# EAGLE design ui_connector (EAGLE 7.4.0)
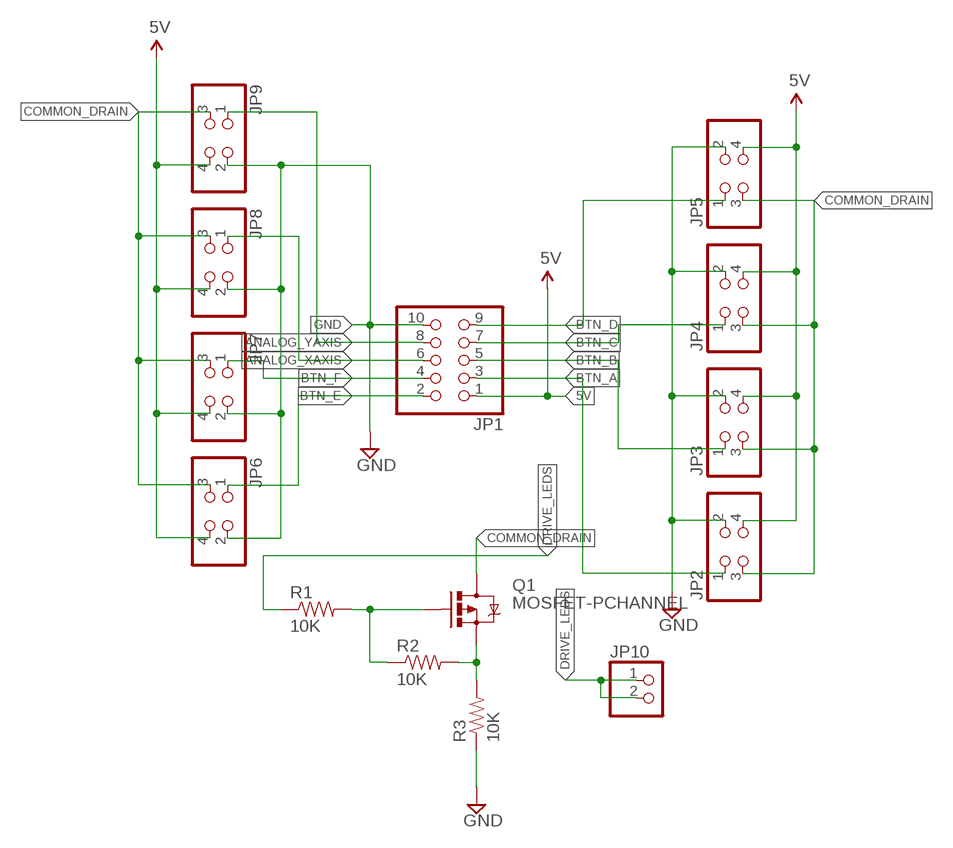
[diagram p0: schematic, sheet 1]

## Parts
JP1  PINHD-2X5  [2X05]
JP2  PINHD-2X2  [2X02]
JP3  PINHD-2X2  [2X02]
JP4  PINHD-2X2  [2X02]
JP5  PINHD-2X2  [2X02]
JP6  PINHD-2X2  [2X02]
JP7  PINHD-2X2  [2X02]
JP8  PINHD-2X2  [2X02]
JP9  PINHD-2X2  [2X02]
JP10  PINHD-1X2  [1X02]
Q1  MOSFET-PCHANNEL  [SOT23-3]
R1  10K  RESISTOR0805-RES  [0805]
R2  10K  RESISTOR0805-RES  [0805]
R3  10K  RESISTOR0805-RES  [0805]

## Nets
5V: JP1.1 JP2.4 JP3.4 JP4.4 JP5.4 JP6.4 JP7.4 JP8.4 JP9.4
ANALOG_XAXIS: JP1.6 JP8.1
ANALOG_YAXIS: JP1.8 JP9.1
BTN_A: JP1.3 JP2.1
BTN_B: JP1.5 JP3.1
BTN_C: JP1.7 JP4.1
BTN_D: JP1.9 JP5.1
BTN_E: JP1.2 JP6.1
BTN_F: JP1.4 JP7.1
COMMON_DRAIN: JP2.3 JP3.3 JP4.3 JP5.3 JP6.3 JP7.3 JP8.3 JP9.3 Q1.3(D)
DRIVE_LEDS: JP10.1 JP10.2 R1.1
GND: JP1.10 JP2.2 JP3.2 JP4.2 JP5.2 JP6.2 JP7.2 JP8.2 JP9.2 R3.1
N$1: Q1.2(S) R2.2 R3.2
N$2: Q1.1(G) R1.2 R2.1

## Library data of the parts
JP1 = pinhead:PINHD-2X5: PIN HEADER
JP2-JP9 = pinhead:PINHD-2X2: PIN HEADER
JP10 = pinhead:PINHD-1X2: PIN HEADER
Q1 = SparkFun-DiscreteSemi:MOSFET-PCHANNEL: Generic PMOSFET IRLML2244 - TRANS-11153 (SOT-23 -20V -4.3A) (1.Gate 2.Source 3.Drain) FQP27P06 - COM-10349 <http://www.sparkfun.com/products/10349> (TO-220 -60V -27A) (1.Gate 2.Source 3.Drain); PROD_ID: TRANS-08285
R1-R3 = SparkFun-Passives:RESISTOR: Resistor Basic schematic elements and footprints for 0603, 1206, and PTH resistors.

## Board
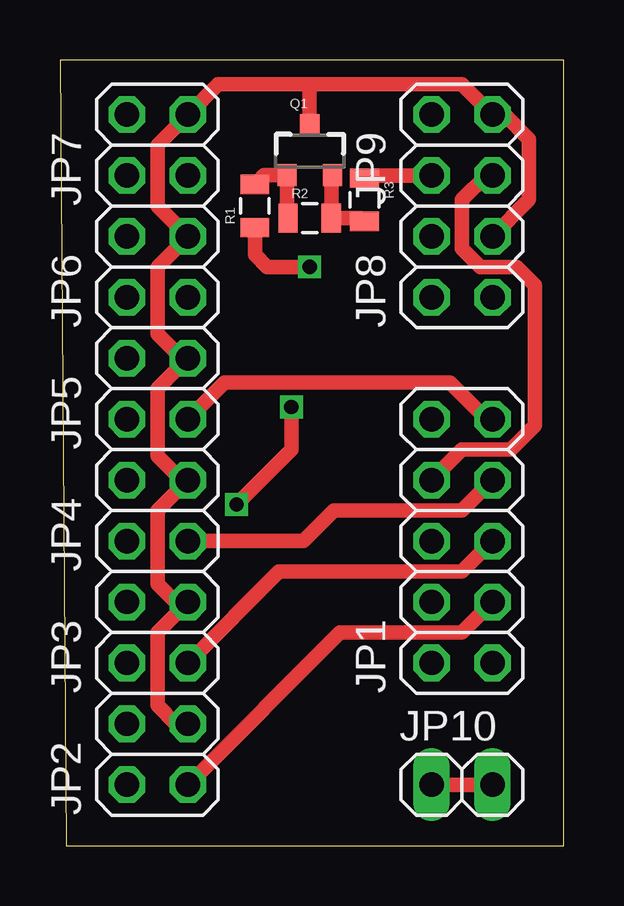
[diagram p1: board, top side]
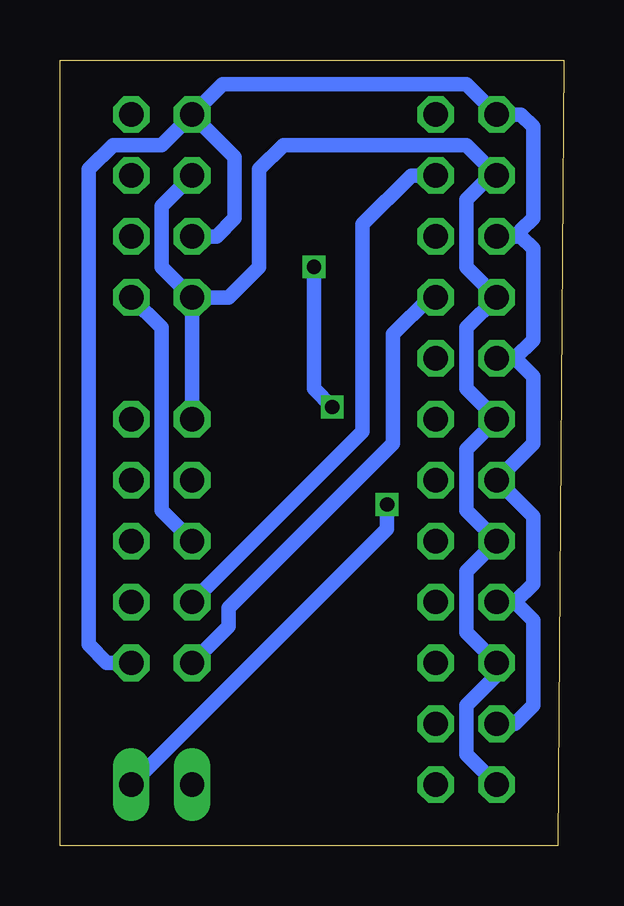
[diagram p2: board, bottom side, seen from below]

Size 21.01 x 32.76 mm. Coordinates in mm from the lower left corner, seen from the top.
Outline: 0.25,0 21.01,0 21.01,32.76 0,32.76 0.25,0
Copper layers (1*16): Top 0.0356mm / dielectric 1.5011mm / Bottom 0.0356mm
Design rules "LaenPCBOrder": minimum track width 6mil, minimum drill 13mil, track to track 6mil, track to pad 6mil, pad to pad 6mil, via to via 6mil, smd to smd 6mil, copper to edge 15mil, drill to drill 6mil, minimum pad ring 7mil, minimum via ring 7mil, stop-mask expansion 3mil, vias tented up to drill 0mil, thermal gap 10mil

### Footprints (pad centres in the part's own frame; a part is rotated, then mirrored left to right if it is on the bottom)
2X05 = drill 1.016 octagon: 1 -5.08,-1.27; 2 -5.08,1.27; 3 -2.54,-1.27; 4 -2.54,1.27; 5 0,-1.27; 6 0,1.27; 7 2.54,-1.27; 8 2.54,1.27; 9 5.08,-1.27; 10 5.08,1.27
2X02 = drill 1.016 octagon: 1 -1.27,-1.27; 2 -1.27,1.27; 3 1.27,-1.27; 4 1.27,1.27
1X02 = drill 1.016 long: 1 -1.27,0; 2 1.27,0
SOT23-3 = smd 0.8 x 0.9: 1 -0.95,-1; 2 0.95,-1; 3 0,1.1
0805 = smd 0.8 x 1.2: 1 -0.9,0; 2 0.9,0

### Placement (x,y rotation side)
JP1  16.76,12.7 90 top
JP2  4.06,3.81 90 top
JP3  4.06,8.89 90 top
JP4  4.06,13.97 90 top
JP5  4.06,19.05 90 top
JP6  4.06,24.13 90 top
JP7  4.06,29.21 90 top
JP8  16.76,24.13 90 top
JP9  16.76,29.21 90 top
JP10  16.76,2.54 0 top
Q1  10.41,28.96 0 top
R1  8.13,26.67 90 top
R2  10.41,26.16 0 top
R3  12.7,26.92 270 top

### Tracks (layer width: path | path; a pad name or v marks a point on that pad's centre or on a via)
5V
  Bottom 0.61: JP2.4 2.03,5.08 1.27,5.84 1.27,9.4 2.03,10.16 | JP3.4 2.03,10.16 | 2.03,10.16 1.27,10.92 1.27,13.72 JP4.4 1.27,16.76 1.27,19.56 2.03,20.32 | JP5.4 2.03,20.32 | JP6.4 1.78,25.4 | 1.78,25.4 1.27,24.89 1.27,21.08 2.03,20.32 | 1.78,25.4 1.78,25.65 1.27,26.16 1.27,29.97 1.78,30.48 JP7.4 4.06,31.75 14.22,31.75 JP9.4 | JP8.4 14.48,25.4 13.72,26.16 13.72,28.7 JP9.4 | JP1.1 19.05,7.62 19.81,8.38 19.81,28.19 18.8,29.21 16.76,29.21 JP9.4
ANALOG_XAXIS
  Bottom 0.61: JP1.6 16.76,13.97 16.76,21.59 JP8.1
ANALOG_YAXIS
  Top 0.61: JP1.8 16.76,16.51 18.8,16.51 19.81,17.53 19.81,23.37 19.05,24.13 17.53,24.13 16.76,24.89 16.76,26.92 17.78,27.94 JP9.1
BTN_A
  Top 0.61: JP2.1 11.68,8.89 16.76,8.89 JP1.3
BTN_B
  Top 0.61: JP3.1 9.14,11.43 16.76,11.43 JP1.5
BTN_C
  Top 0.61: JP1.7 16.76,13.97 11.43,13.97 10.16,12.7 JP4.1
BTN_D
  Top 0.61: JP5.1 6.86,19.3 16.26,19.3 17.78,17.78 JP1.9
BTN_E
  Bottom 0.61: JP1.2 13.97,9.14 13.97,9.91 7.11,16.76 7.11,21.34 5.59,22.86 JP6.1
BTN_F
  Bottom 0.61: JP1.4 8.38,17.27 8.38,25.91 6.35,27.94 JP7.1
COMMON_DRAIN
  Top 0.61: JP8.3 19.56,26.92 19.56,29.46 18.54,30.48 JP9.3 16.76,31.75 10.41,31.75 | 10.41,31.75 6.6,31.75 JP7.3 4.06,29.21 4.06,26.67 JP6.3 4.06,24.13 4.06,21.34 5.08,20.32 JP5.3 4.06,19.05 4.06,16.26 5.08,15.24 JP4.3 4.06,13.97 4.06,10.92 4.83,10.16 JP3.3 4.06,8.89 4.06,5.84 4.83,5.08 JP2.3 | Q1.3 10.41,31.75
DRIVE_LEDS  (via drill 0.6)
  Top 0.61: JP10.1 JP10.2 | v9.65,18.29 9.65,17.53 9.65,17.27 9.65,16.51 v7.37,14.22 | v10.41,24.13 8.64,24.13 8.13,24.64 R1.1
  Bottom 0.61: JP10.2 7.37,13.21 v7.37,14.22 | v9.65,18.29 10.41,19.05 v10.41,24.13
GND
  Top 0.61: R3.1 12.82,27.94 JP9.2
  Bottom 0.61: JP2.2 4.06,3.81 4.06,5.84 2.79,7.11 JP3.2 4.06,8.89 4.06,11.43 JP4.2 4.06,13.97 4.06,16.51 JP5.2 4.06,19.05 4.06,21.59 JP6.2 4.06,24.13 4.06,26.92 3.05,27.94 JP7.2 4.06,29.21 11.68,29.21 12.7,28.19 12.7,24.13 13.97,22.86 JP8.2 | JP9.2 16.76,26.67 16.76,24.13 JP8.2 | JP1.10 JP8.2
N$1
  Top 0.61: R3.2 12.56,26.16 R2.2 11.31,27.91 Q1.2
N$2
  Top 0.61: R2.1 9.46,26.21 Q1.1 8.51,27.96 R1.2